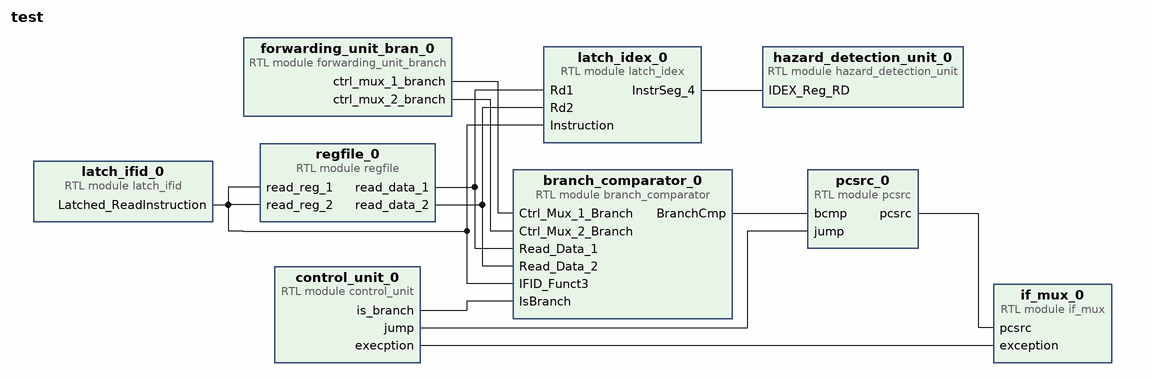
[diagram p0: block diagram of the top level]
# Vivado block design test, xc7z020clg484-1, Vivado 2019.2.1
create_bd_design test

create_bd_cell -type module -reference pcsrc pcsrc_0
create_bd_cell -type module -reference regfile regfile_0
create_bd_cell -type module -reference if_mux if_mux_0
create_bd_cell -type module -reference control_unit control_unit_0
create_bd_cell -type module -reference forwarding_unit_branch forwarding_unit_bran_0
create_bd_cell -type module -reference branch_comparator branch_comparator_0
create_bd_cell -type module -reference hazard_detection_unit hazard_detection_unit_0
create_bd_cell -type module -reference latch_ifid latch_ifid_0
create_bd_cell -type module -reference latch_idex latch_idex_0

# ---- connections ----

connect_bd_net [get_bd_pins pcsrc_0/pcsrc] [get_bd_pins if_mux_0/pcsrc]
connect_bd_net [get_bd_pins control_unit_0/jump] [get_bd_pins pcsrc_0/jump]
connect_bd_net [get_bd_pins control_unit_0/execption] [get_bd_pins if_mux_0/exception]
connect_bd_net [get_bd_pins regfile_0/read_data_1] [get_bd_pins branch_comparator_0/Read_Data_1] [get_bd_pins latch_idex_0/Rd1]
connect_bd_net [get_bd_pins regfile_0/read_data_2] [get_bd_pins branch_comparator_0/Read_Data_2] [get_bd_pins latch_idex_0/Rd2]
connect_bd_net [get_bd_pins forwarding_unit_bran_0/ctrl_mux_1_branch] [get_bd_pins branch_comparator_0/Ctrl_Mux_1_Branch]
connect_bd_net [get_bd_pins forwarding_unit_bran_0/ctrl_mux_2_branch] [get_bd_pins branch_comparator_0/Ctrl_Mux_2_Branch]
connect_bd_net [get_bd_pins branch_comparator_0/BranchCmp] [get_bd_pins pcsrc_0/bcmp]
connect_bd_net [get_bd_pins control_unit_0/is_branch] [get_bd_pins branch_comparator_0/IsBranch]
connect_bd_net [get_bd_pins latch_ifid_0/Latched_ReadInstruction] \
  [get_bd_pins regfile_0/read_reg_1] [get_bd_pins regfile_0/read_reg_2] [get_bd_pins branch_comparator_0/IFID_Funct3] \
  [get_bd_pins latch_idex_0/Instruction]
connect_bd_net [get_bd_pins latch_idex_0/InstrSeg_4] [get_bd_pins hazard_detection_unit_0/IDEX_Reg_RD]

validate_bd_design
save_bd_design
